# Altium project USB_HUBwithSTLink.PrjPcb
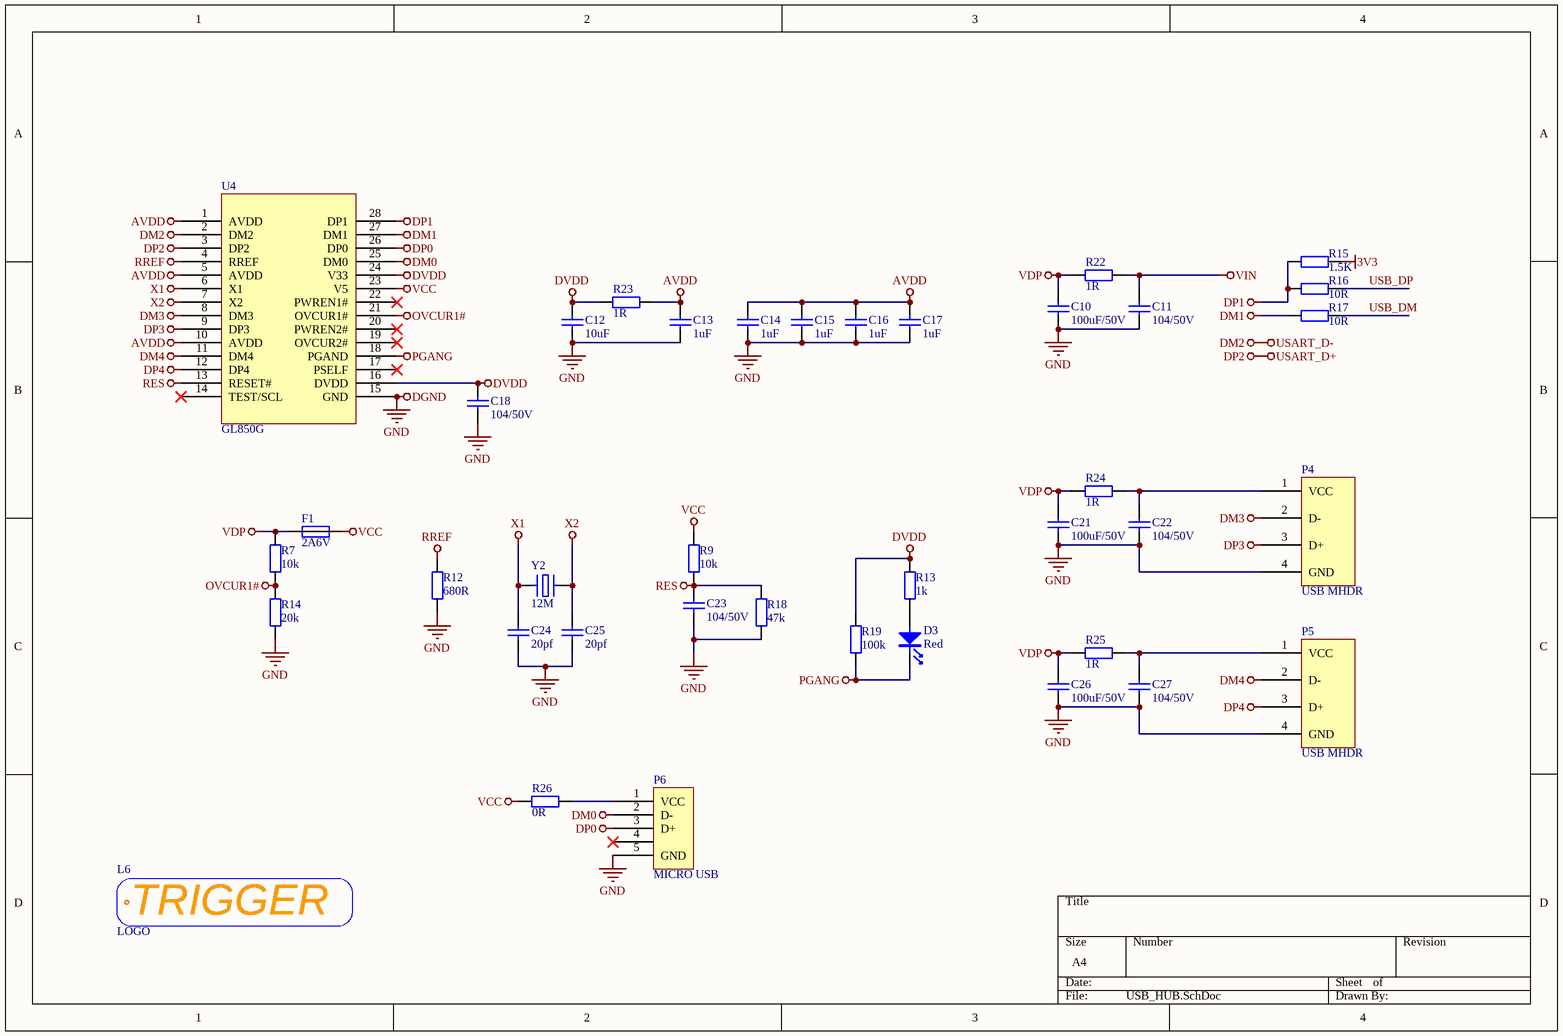
[diagram p0: USB_HUB.SchDoc]
2 sheets, 68 parts. Net scope: global (net labels, ports and power ports of the same name join across sheets).
Board file: USB_HUBwithSTLink.PcbDoc
Sheets:
  USB_HUB.SchDoc
  STlink.SchDoc

## Sheet USB_HUB.SchDoc
size A4

### Parts
C10  _Parameter: 100uF/50V  [电容_C1206]  (hidden comment: 100uF)
C11  _Parameter: 104/50V  [电容_C0603]  (hidden comment: 104)
C12  _Parameter: 10uF  [电容_C0603]  (hidden comment: 20PF)
C13  _Parameter: 1uF  [电容_C0603]  (hidden comment: 20PF)
C14  _Parameter: 1uF  [电容_C0603]  (hidden comment: 20PF)
C15  _Parameter: 1uF  [电容_C0603]  (hidden comment: 20PF)
C16  _Parameter: 1uF  [电容_C0603]  (hidden comment: 20PF)
C17  _Parameter: 1uF  [电容_C0603]  (hidden comment: 20PF)
C18  _Parameter: 104/50V  [电容_C0603]  (hidden comment: 104)
C21  _Parameter: 100uF/50V  [电容_C1206]  (hidden comment: 100uF)
C22  _Parameter: 104/50V  [电容_C0603]  (hidden comment: 104)
C23  _Parameter: 104/50V  [电容_C0603]  (hidden comment: 104)
C24  20PF  [电容_C0603]
C25  20PF  [电容_C0603]
C26  _Parameter: 100uF/50V  [电容_C1206]  (hidden comment: 100uF)
C27  _Parameter: 104/50V  [电容_C0603]  (hidden comment: 104)
D3  Red  [LED_0603]
F1  2A6V  [电阻_R1206]
L6  LOGO  [LOGO L BS]
P4  USB MHDR  [接插件_USB母座 前贴后插 卷边 短体10]
P5  USB MHDR  [接插件_USB母座 前贴后插 卷边 短体10]
P6  MICRO USB  [接插件_MICRO 牛角插座 USB 直边]
R7  10k  [电阻_R0603]
R9  10k  [电阻_R0603]
R12  680R  [电阻_R0603]
R13  1k  [电阻_R0603]
R14  20k  [电阻_R0603]
R15  1.5K  [电阻_R0603]
R16  10R  [电阻_R0603]
R17  10R  [电阻_R0603]
R18  47k  [电阻_R0603]
R19  100k  [电阻_R0603]
R22  1R  [电阻_R0603]
R23  1R  [电阻_R0603]
R24  1R  [电阻_R0603]
R25  1R  [电阻_R0603]
R26  0R  [电阻_R0603]
U4  GL850G  [SSOP28]
Y2  12M  [晶振_3225]

### Nets
3V3: R15.1
AVDD: C13.2 C14.2 C15.2 C16.2 C17.2 R23.2 U4.1(AVDD) U4.5(AVDD) U4.10(AVDD)
DGND: C10.1 C11.1 C12.1 C13.1 C14.1 C15.1 C16.1 C17.1 C18.1 C21.1 C22.1 C23.1 C24.1 C25.1 C26.1 C27.1 P4.0(GND) P4.4(GND) P5.0(GND) P5.4(GND) P6.0 P6.5(GND) R12.1 R14.1 R18.1 U4.15(GND) Y2.0  [also labelled GND]
DM0: P6.2(D-) U4.25(DM0)
DM1: R17.2 U4.27(DM1)
DM2: U4.2(DM2)  [also labelled USART_D-]
DM3: P4.2(D-) U4.8(DM3)
DM4: P5.2(D-) U4.11(DM4)
DP0: P6.3(D+) U4.26(DP0)
DP1: R15.2 R16.2 U4.28(DP1)
DP2: U4.3(DP2)  [also labelled USART_D+]
DP3: P4.3(D+) U4.9(DP3)
DP4: P5.3(D+) U4.12(DP4)
DVDD: C12.2 C18.2 R13.2 R19.2 R23.1 U4.16(DVDD) U4.24(V33)
OVCUR1#: R7.1 R14.2 U4.21(OVCUR1#)
PGANG: D3.K R19.1 U4.18(PGAND)
RES: C23.2 R9.1 R18.2 U4.13(RESET#)
RREF: R12.2 U4.4(RREF)
VCC: F1.2 R9.2 R26.1 U4.23(V5)
VDP: C10.2 C21.2 C26.2 F1.1 R7.2 R22.1 R24.1 R25.1
VIN: C11.2 R22.2
X1: C24.2 U4.6(X1) Y2.1
X2: C25.2 U4.7(X2) Y2.2
USB_DM: R17.1
USB_DP: R16.1
NetC22_2: C22.2 P4.1(VCC) R24.2
NetC27_2: C27.2 P5.1(VCC) R25.2
NetD3_A: D3.A R13.1
NetP6_1: P6.1(VCC) R26.2

Not connected (* = marked no-connect by the designer): P6 4*; U4 14(TEST/SCL)* 17(PSELF)* 19(OVCUR2#)* 20(PWREN2#)* 22(PWREN1#)*

### Notes on the sheet
- (in symbol LOGO_TRIGGER) TRIGGER

### Library data of the parts
C10 C21 C26 = Cap: _Material: X7R; _Voltage: 50V; _Slash: /; _Specification: Cap,0805,X7R,100uF,50V,10%; _Comma: ,; _Accuracy: 10%; _Footprint: 0805; _Capacitance: 100uF; _Name: Cap
C11 C18 C22 C23 C27 = Cap: _Material: X7R; _Voltage: 50V; _Slash: /; _Specification: Cap,0805,X7R,104,50V,10%; _Comma: ,; _Accuracy: 10%; _Footprint: 0805; _Capacitance: 104; _Name: Cap
C12-C17 C24 C25 = Cap: _Material: X7R; _Voltage: 50V; _Slash: /; _Specification: Cap,0805,X7R,20PF,50V,10%; _Comma: ,; _Accuracy: 10%; _Footprint: 0805; _Capacitance: 20PF; _Name: Cap
  C24 C25: _Parameter: 20pf
D3 = LED: _Comma: ,; _Footprint: 0603; _Specification: LED,0603,Red; _Name: LED; _Color: Red
F1 = Fuse: _Comma: ,; _Footprint: D5*20; _Specification: Fuse,*,D5*20,2A6V; _Model: *; _Name: Fuse; _Current: 2A6V
L6 = LOGO_TRIGGER
P4 P5 = USB MHDR: _Comma: ,; _Name: Port; _Specification: Port,USB MHDR,AF,90°; _Value: AF,90°; _Model: USB MHDR
P6 = MICRO USB 5PIN: _Comma: ,; _Name: Port; _Specification: Port,MICRO USB,5PIN; _Value: 5PIN; _Model: MICRO USB
R7 R9 = Res: _Accuracy: 1%; _Power: 1/8W; _Footprint: 0805; _Drift: 100ppm; _Comma: ,; _Specification: Res,0805,10k,1%,1/8W,100ppm; _Name: Res; _Value: 10k
R12 = Res: _Accuracy: 1%; _Power: 1/8W; _Footprint: 0805; _Drift: 100ppm; _Comma: ,; _Specification: Res,0805,680R,1%,1/8W,100ppm; _Name: Res; _Value: 680R
R13 = Res: _Accuracy: 1%; _Power: 1/8W; _Footprint: 0805; _Drift: 100ppm; _Comma: ,; _Specification: Res,0805,1k,1%,1/8W,100ppm; _Name: Res; _Value: 1k
R14 = Res: _Accuracy: 1%; _Power: 1/8W; _Footprint: 0805; _Drift: 100ppm; _Comma: ,; _Specification: Res,0805,20k,1%,1/8W,100ppm; _Name: Res; _Value: 20k
R15-R17 = Res: P: 1/8W; 参数: Res,0805,0R,±1%,1/8W,100ppm,155C
  R15: R: 1.5K
  R16 R17: R: 10R
R18 = Res: _Accuracy: 1%; _Power: 1/8W; _Footprint: 0805; _Drift: 100ppm; _Comma: ,; _Specification: Res,0805,47k,1%,1/8W,100ppm; _Name: Res; _Value: 47k
R19 = Res: _Accuracy: 1%; _Power: 1/8W; _Footprint: 0805; _Drift: 100ppm; _Comma: ,; _Specification: Res,0805,100k,1%,1/8W,100ppm; _Name: Res; _Value: 100k
R22-R25 = Res: _Accuracy: 1%; _Power: 1/8W; _Footprint: 0805; _Drift: 100ppm; _Comma: ,; _Specification: Res,0805,1R,1%,1/8W,100ppm; _Name: Res; _Value: 1R
R26 = Res: _Accuracy: 1%; _Power: 1/8W; _Footprint: 0805; _Drift: 100ppm; _Comma: ,; _Specification: Res,0805,0R,1%,1/8W,100ppm; _Name: Res; _Value: 0R
U4 = GL850G: USBHUB
Y2 = XTAL_B: _Comma: ,; _Footprint: 5032; _Name: CRYSTALS; _Specification: CRYSTALS,12M,5032,10ppm,12pF; _Accuracy: 10ppm; _CL: 12pF; _Frequency: 12M

## Sheet STlink.SchDoc
size A4
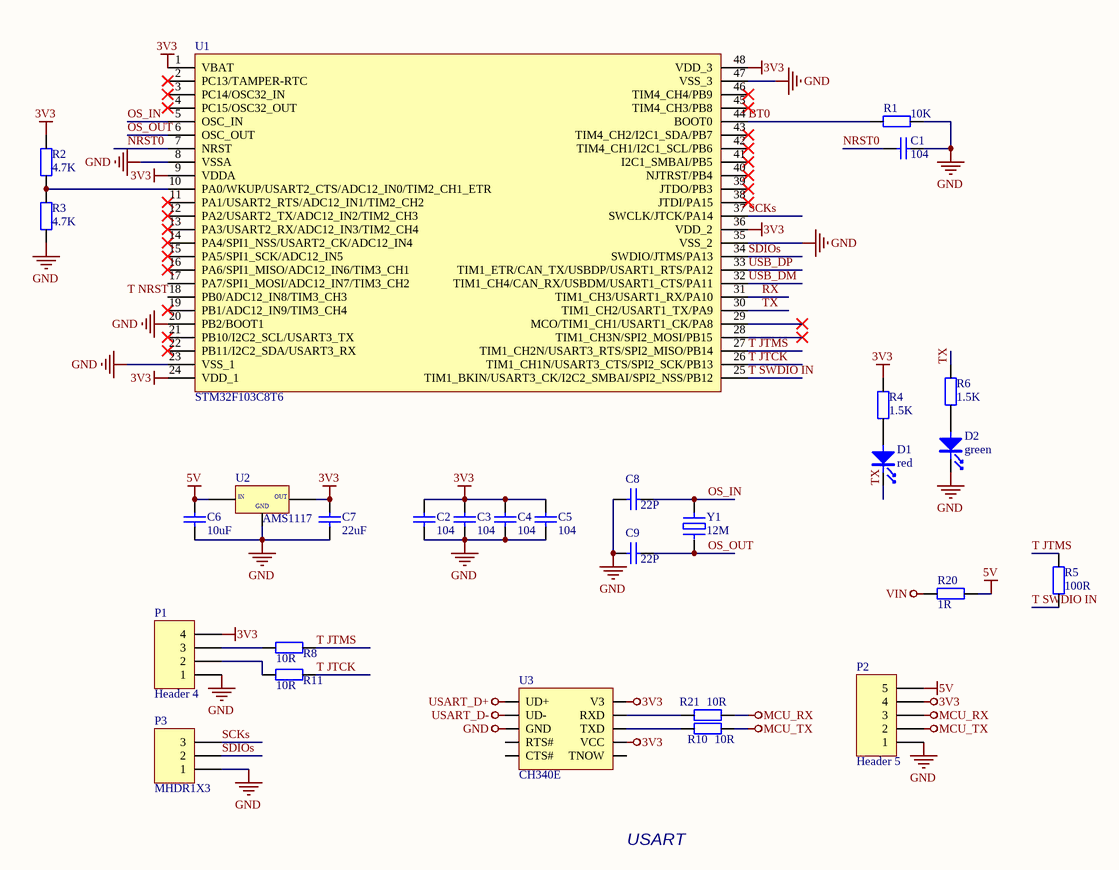
[diagram p1: STlink.SchDoc]

### Parts
C1  104  [电容_C0603]
C2  104  [电容_C0603]
C3  104  [电容_C0603]
C4  104  [电容_C0603]
C5  104  [电容_C0603]
C6  10uF  [电容_C1206]
C7  22uF  [电容_C1206]
C8  22P  [电容_C0603]
C9  22P  [电容_C0603]
D1  red  [LED_0603]
D2  green  [LED_0603]
P1  Header 4  [HDR1X4]
P2  Header 5  [HDR1X5]
P3  MHDR1X3  [MHDR1X3]
R1  10K  [电阻_R0603]
R2  4.7K  [电阻_R0603]
R3  4.7K  [电阻_R0603]
R4  1.5K  [电阻_R0603]
R5  100R  [电阻_R0603]
R6  1.5K  [电阻_R0603]
R8  10R  [电阻_R0603]
R10  10R  [电阻_R0603]
R11  10R  [电阻_R0603]
R20  1R  [电阻_R0603]
R21  10R  [电阻_R0603]
U1  STM32F103C8T6  [ST主控_LQFP48]
U2  AMS1117  [稳压芯片_SOT-223]
U3  CH340E  [MSOP10]
Y1  12M  [晶振_3225]

### Nets
3V3: C2.1 C3.1 C4.1 C5.1 C7.2 P1.4 P2.4 R2.2 R4.2 U1.1(VBAT) U1.9(VDDA) U1.24(VDD_1) U1.36(VDD_2) U1.48(VDD_3) U2.2(OUT) U3.7(VCC) U3.10(V3)
5V: C6.2 P2.5 R20.1 U2.3(VIN)
GND: C1.2 C2.2 C3.2 C4.2 C5.2 C6.1 C7.1 C8.2 C9.2 D2.K P1.1 P2.1 P3.1 R1.1 R3.1 U1.8(VSSA) U1.20(PB2/BOOT1) U1.23(VSS_1) U1.35(VSS_2) U1.47(VSS_3) U2.1(GND) U3.3(GND) Y1.0  [project net DGND]
MCU_RX: P2.3 R21.1
MCU_TX: P2.2 R10.1
USART_D+: U3.1(UD+)  [project net DP2]
USART_D-: U3.2(UD-)  [project net DM2]
VIN: R20.2
BT0: R1.2 U1.44(BOOT0)
NRST0: C1.1 U1.7(NRST)
OS_IN: C8.1 U1.5(OSC_IN) Y1.1
OS_OUT: C9.1 U1.6(OSC_OUT) Y1.2
RX: U1.31(TIM1_CH3/USART1_RX/PA10)
SCKs: P3.3 U1.37(SWCLK/JTCK/PA14)
SDIOs: P3.2 U1.34(SWDIO/JTMS/PA13)
T JTCK: R11.1 U1.26(TIM1_CH1N/USART3_CTS/SPI2_SCK/PB13)
T JTMS: R5.2 R8.1 U1.27(TIM1_CH2N/USART3_RTS/SPI2_MISO/PB14)
T SWDIO IN: R5.1 U1.25(TIM1_BKIN/USART3_CK/I2C2_SMBAI/SPI2_NSS/PB12)
TX: D1.K R6.2 U1.30(TIM1_CH2/USART1_TX/PA9)
USB_DM: U1.32(TIM1_CH4/CAN_RX/USBDM/USART1_CTS/PA11)
USB_DP: U1.33(TIM1_ETR/CAN_TX/USBDP/USART1_RTS/PA12)
NetD1_A: D1.A R4.1
NetD2_A: D2.A R6.1
NetP1_2: P1.2 R11.2
NetP1_3: P1.3 R8.2
NetR2_1: R2.1 R3.2 U1.10(PA0/WKUP/USART2_CTS/ADC12_IN0/TIM2_CH1_ETR)
NetR10_2: R10.2 U3.8(TXD)
NetR21_2: R21.2 U3.9(RXD)

Not connected (* = marked no-connect by the designer): U1 2(PC13/TAMPER-RTC)* 3(PC14/OSC32_IN)* 4(PC15/OSC32_OUT)* 11(PA1/USART2_RTS/ADC12_IN1/TIM2_CH2)* 12(PA2/USART2_TX/ADC12_IN2/TIM2_CH3)* 13(PA3/USART2_RX/ADC12_IN3/TIM2_CH4)* 14(PA4/SPI1_NSS/USART2_CK/ADC12_IN4)* 15(PA5/SPI1_SCK/ADC12_IN5)* 16(PA6/SPI1_MISO/ADC12_IN6/TIM3_CH1)* 17(PA7/SPI1_MOSI/ADC12_IN7/TIM3_CH2) 18(PB0/ADC12_IN8/TIM3_CH3) 19(PB1/ADC12_IN9/TIM3_CH4)* 21(PB10/I2C2_SCL/USART3_TX)* 22(PB11/I2C2_SDA/USART3_RX)* 28(TIM1_CH3N/SPI2_MOSI/PB15)* 29(MCO/TIM1_CH1/USART1_CK/PA8)* 38(JTDI/PA15)* 39(JTDO/PB3)* 40(NJTRST/PB4)* 41(I2C1_SMBAI/PB5)* 42(TIM4_CH1/I2C1_SCL/PB6)* 43(TIM4_CH2/I2C1_SDA/PB7)* 45(TIM4_CH3/PB8)* 46(TIM4_CH4/PB9)*; U3 4(RTS#) 5(CTS#) 6(TNOW)

### Notes on the sheet
- USART
- Labels drawn without touching a wire or pin: T NRST
- (in symbol AMS1117) IN

### Library data of the parts
C1-C9 = cap: U: 50V; 参数: Cap,0805,X7R,104K,50V,125C,±10%
  C1-C5: C: 104
  C6: C: 10uF
  C7: C: 22uF
  C8 C9: C: 22P
D1 D2 = LED: 参数: LED,0603,Red
P1 = Header 4: Header, 4-Pin; LatestRevisionDate: 17-Jul-2002; LatestRevisionNote: Re-released for DXP Platform.; Publisher: Altium Limited
P2 = Header 5: Header, 5-Pin; LatestRevisionDate: 17-Jul-2002; LatestRevisionNote: Re-released for DXP Platform.; Publisher: Altium Limited
P3 = MHDR1X3: Header, 3-Pin; LatestRevisionDate: 17-Jul-2002; LatestRevisionNote: Re-released for DXP Platform.; Publisher: Altium Limited
R1-R6 R8 R10 R11 R20 R21 = Res: as R15 on sheet USB_HUB
  R1: R: 10K
  R2 R3: R: 4.7K
  R4 R6: R: 1.5K
  R5: R: 100R
  R8 R10 R11 R21: R: 10R
  R20: R: 1R
Y1 = XTAL_B: as Y2 on sheet USB_HUB; _Frequency: 12M

## Nets that join several sheets
3V3: USB_HUB (R15.1), STlink (17 pins)
DGND: USB_HUB (27 pins), STlink (23 pins)
DM2: USB_HUB (U4.2), STlink (U3.2)
DP2: USB_HUB (U4.3), STlink (U3.1)
VIN: USB_HUB (C11.2 R22.2), STlink (R20.2)
USB_DM: USB_HUB (R17.1), STlink (U1.32)
USB_DP: USB_HUB (R16.1), STlink (U1.33)